# EAGLE schematic Aux Board V7.0 (EAGLE 9.6.2)

## Sheet 1 of 2
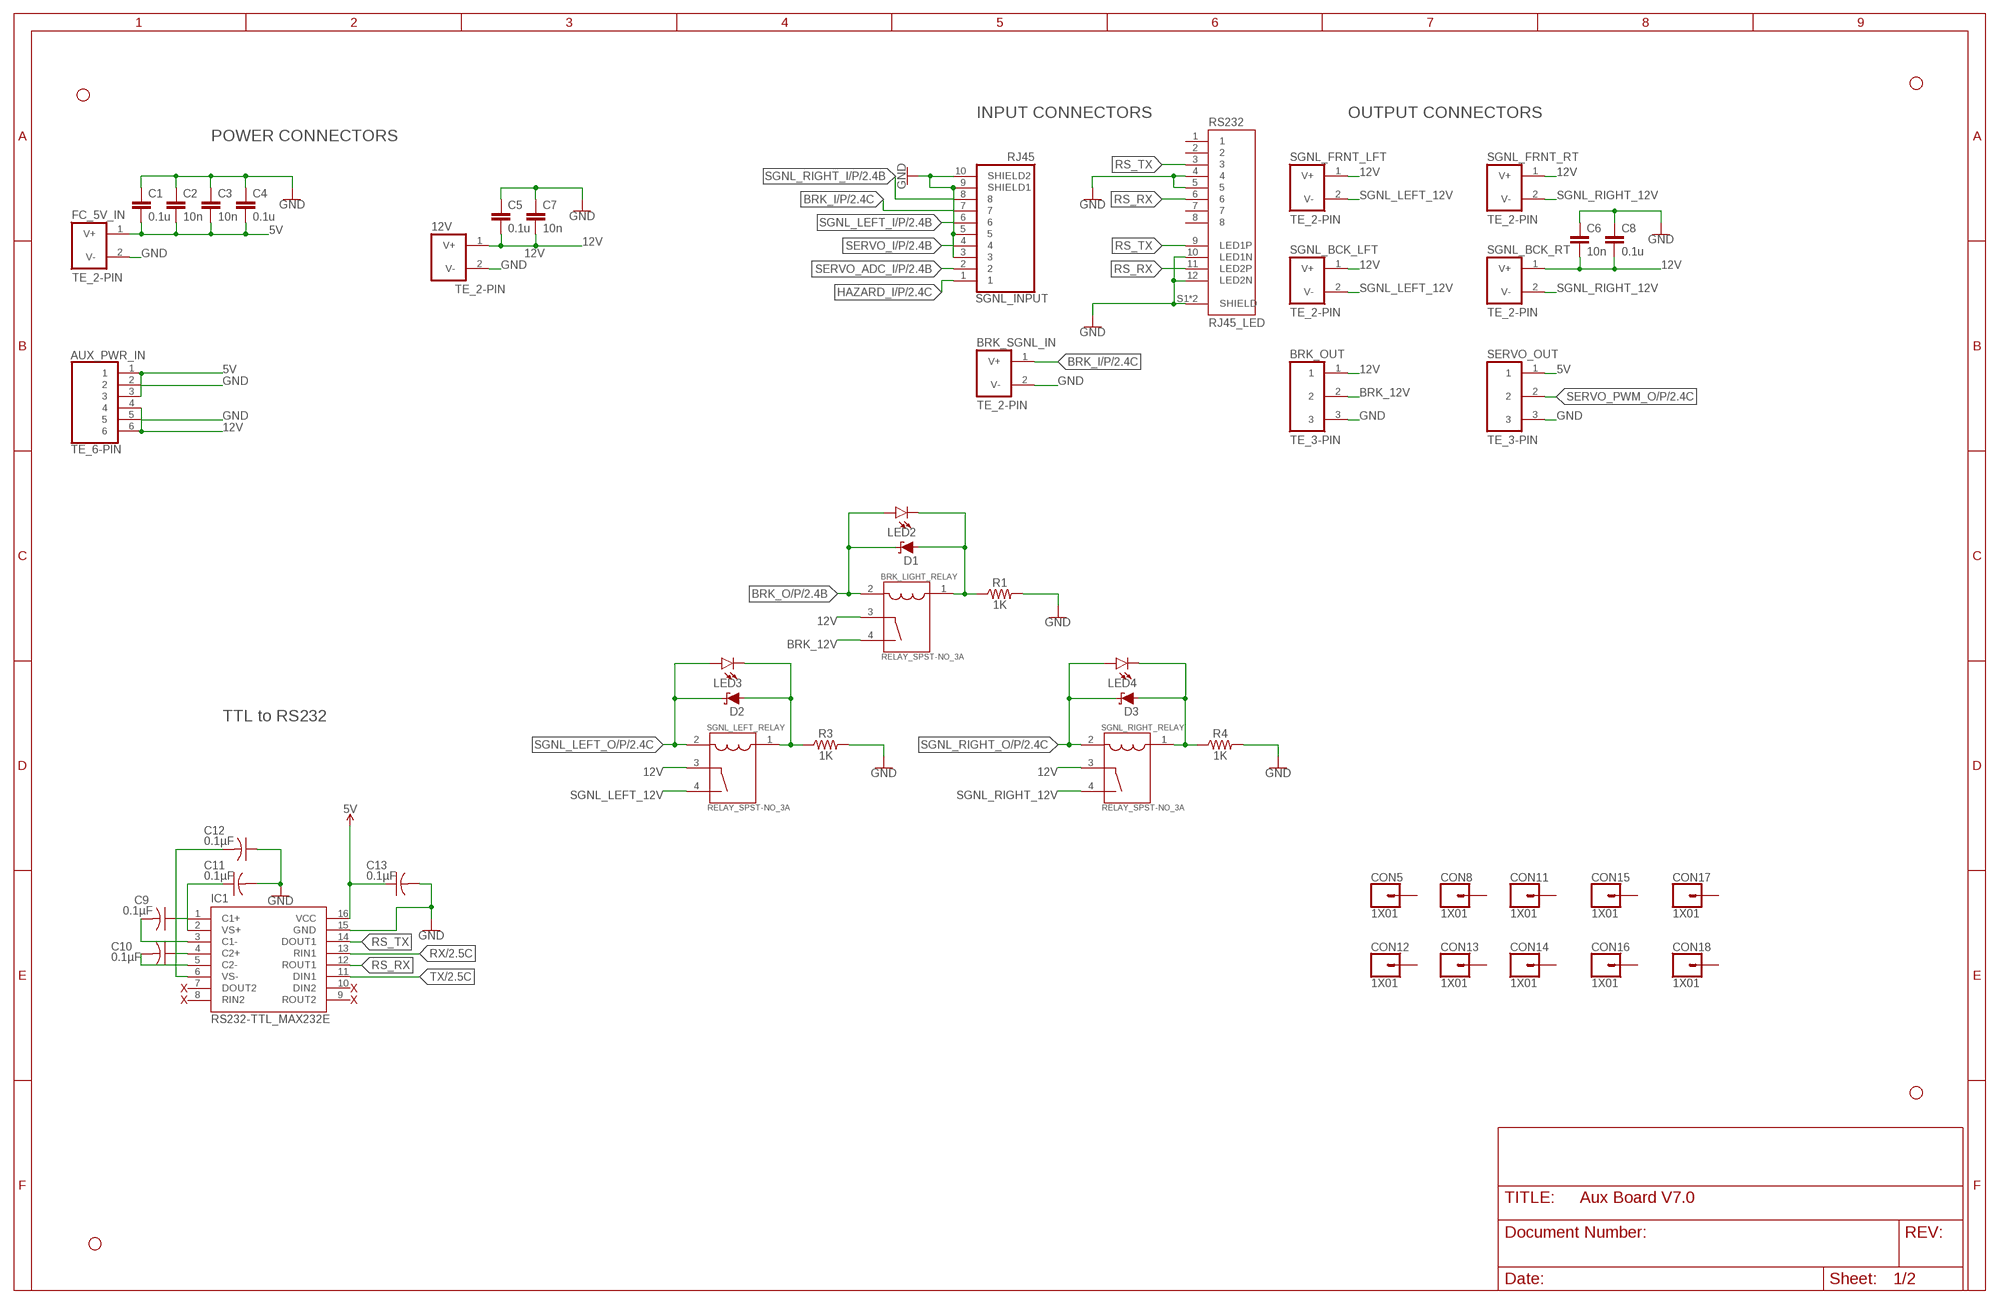
[diagram p0: schematic, sheet 1]

### Parts
12V  TE_2-PIN  [TE_2-PIN]
AUX_PWR_IN  TE_6-PIN  [TE_6-PIN]
BRK_LIGHT_RELAY  RELAY_SPST-NO_3A  [TE_1-1721081-2]
BRK_OUT  TE_3-PIN  [TE_3-PIN]
BRK_SGNL_IN  TE_2-PIN  [TE_2-PIN]
C1  0.1u  CAPACITOR_0805  [0805]
C2  10n  CAPACITOR_0805  [0805]
C3  10n  CAPACITOR_0805  [0805]
C4  0.1u  CAPACITOR_0805  [0805]
C5  0.1u  CAPACITOR_0805  [0805]
C6  10n  CAPACITOR_0805  [0805]
C7  10n  CAPACITOR_0805  [0805]
C8  0.1u  CAPACITOR_0805  [0805]
C9  0.1µF  C-USC0805  [C0805]
C10  0.1µF  C-USC0805  [C0805]
C11  0.1µF  C-USC0805  [C0805]
C12  0.1µF  C-USC0805  [C0805]
C13  0.1µF  C-USC0805  [C0805]
CON5  1X01  [1X01]
CON8  1X01  [1X01]
CON11  1X01  [1X01]
CON12  1X01  [1X01]
CON13  1X01  [1X01]
CON14  1X01  [1X01]
CON15  1X01  [1X01]
CON16  1X01  [1X01]
CON17  1X01  [1X01]
CON18  1X01  [1X01]
D1  DIODE_SCHOTTKY_DO-214AA  [DO214AA]
D2  DIODE_SCHOTTKY_DO-214AA  [DO214AA]
D3  DIODE_SCHOTTKY_DO-214AA  [DO214AA]
FC_5V_IN  TE_2-PIN  [TE_2-PIN]
H1  STAND-OFF  [STAND-OFF]
H2  STAND-OFF  [STAND-OFF]
H3  STAND-OFF  [STAND-OFF]
H4  STAND-OFF  [STAND-OFF]
IC1  RS232-TTL_MAX232E  [DIP16]
LED2  LED_0805  [0805_LED]
LED3  LED_0805  [0805_LED]
LED4  LED_0805  [0805_LED]
R1  1K  RESISTOR_0805  [0805]
R3  1K  RESISTOR_0805  [0805]
R4  1K  RESISTOR_0805  [0805]
RS232  RJ45_LED  [RJ45_LED]
SERVO_OUT  TE_3-PIN  [TE_3-PIN]
SGNL_BCK_LFT  TE_2-PIN  [TE_2-PIN]
SGNL_BCK_RT  TE_2-PIN  [TE_2-PIN]
SGNL_FRNT_LFT  TE_2-PIN  [TE_2-PIN]
SGNL_FRNT_RT  TE_2-PIN  [TE_2-PIN]
SGNL_INPUT  RJ45  [RJ45]
SGNL_LEFT_RELAY  RELAY_SPST-NO_3A  [TE_1-1721081-2]
SGNL_RIGHT_RELAY  RELAY_SPST-NO_3A  [TE_1-1721081-2]

### Nets
5V: AUX_PWR_IN.1 AUX_PWR_IN.3 C1.2 C2.2 C3.2 C4.2 C13.1 FC_5V_IN.1(V+) IC1.16(VCC) SERVO_OUT.1 ; also sheet 2
12V: 12V.1(V+) AUX_PWR_IN.4 AUX_PWR_IN.6 BRK_LIGHT_RELAY.3 BRK_OUT.1 C5.2 C6.2 C7.2 C8.2 SGNL_BCK_LFT.1(V+) SGNL_BCK_RT.1(V+) SGNL_FRNT_LFT.1(V+) SGNL_FRNT_RT.1(V+) SGNL_LEFT_RELAY.3 SGNL_RIGHT_RELAY.3
BRK_12V: BRK_LIGHT_RELAY.4 BRK_OUT.2
BRK_I/P: BRK_SGNL_IN.1(V+) SGNL_INPUT.7 ; also sheet 2
BRK_O/P: BRK_LIGHT_RELAY.2 D1.C LED2.1(A) ; also sheet 2
GND: 12V.2(V-) AUX_PWR_IN.2 AUX_PWR_IN.5 BRK_OUT.3 BRK_SGNL_IN.2(V-) C1.1 C2.1 C3.1 C4.1 C5.1 C6.1 C7.1 C8.1 C11.2 C12.1 C13.2 FC_5V_IN.2(V-) IC1.15(GND) R1.2 R3.2 R4.2 RS232.4 RS232.5 RS232.10(LED1N) RS232.12(LED2N) RS232.S1(SHIELD) RS232.S2(SHIELD) SERVO_OUT.3 SGNL_INPUT.3 SGNL_INPUT.5 SGNL_INPUT.9(SHIELD1) SGNL_INPUT.10(SHIELD2) ; also sheet 2
HAZARD_I/P: SGNL_INPUT.1 ; also sheet 2
N$1: BRK_LIGHT_RELAY.1 D1.A LED2.2(C) R1.1
N$6: C9.2 IC1.3(C1-)
N$7: C10.2 IC1.5(C2-)
N$9: C9.1 IC1.1(C1+)
N$10: C10.1 IC1.4(C2+)
N$11: C11.1 IC1.2(VS+)
N$12: C12.2 IC1.6(VS-)
N$13: D2.A LED3.2(C) R3.1 SGNL_LEFT_RELAY.1
N$14: D3.A LED4.2(C) R4.1 SGNL_RIGHT_RELAY.1
RS_RX: IC1.12(ROUT1) RS232.6 RS232.11(LED2P)
RS_TX: IC1.14(DOUT1) RS232.3 RS232.9(LED1P)
RX: IC1.13(RIN1) ; also sheet 2
SERVO_ADC_I/P: SGNL_INPUT.2 ; also sheet 2
SERVO_I/P: SGNL_INPUT.4 ; also sheet 2
SERVO_PWM_O/P: SERVO_OUT.2 ; also sheet 2
SGNL_LEFT_12V: SGNL_BCK_LFT.2(V-) SGNL_FRNT_LFT.2(V-) SGNL_LEFT_RELAY.4
SGNL_LEFT_I/P: SGNL_INPUT.6 ; also sheet 2
SGNL_LEFT_O/P: D2.C LED3.1(A) SGNL_LEFT_RELAY.2 ; also sheet 2
SGNL_RIGHT_12V: SGNL_BCK_RT.2(V-) SGNL_FRNT_RT.2(V-) SGNL_RIGHT_RELAY.4
SGNL_RIGHT_I/P: SGNL_INPUT.8 ; also sheet 2
SGNL_RIGHT_O/P: D3.C LED4.1(A) SGNL_RIGHT_RELAY.2 ; also sheet 2
TX: IC1.11(DIN1) ; also sheet 2
Unconnected: CON5.1 CON8.1 CON11.1 CON12.1 CON13.1 CON14.1 CON15.1 CON16.1 CON17.1 CON18.1 IC1.7(DOUT2) IC1.8(RIN2) IC1.9(ROUT2) IC1.10(DIN2) RS232.1 RS232.2 RS232.7 RS232.8

### Notes on the sheet
- INPUT CONNECTORS | OUTPUT CONNECTORS
- POWER CONNECTORS
- TTL to RS232
- X | X
- X | X

## Sheet 2 of 2
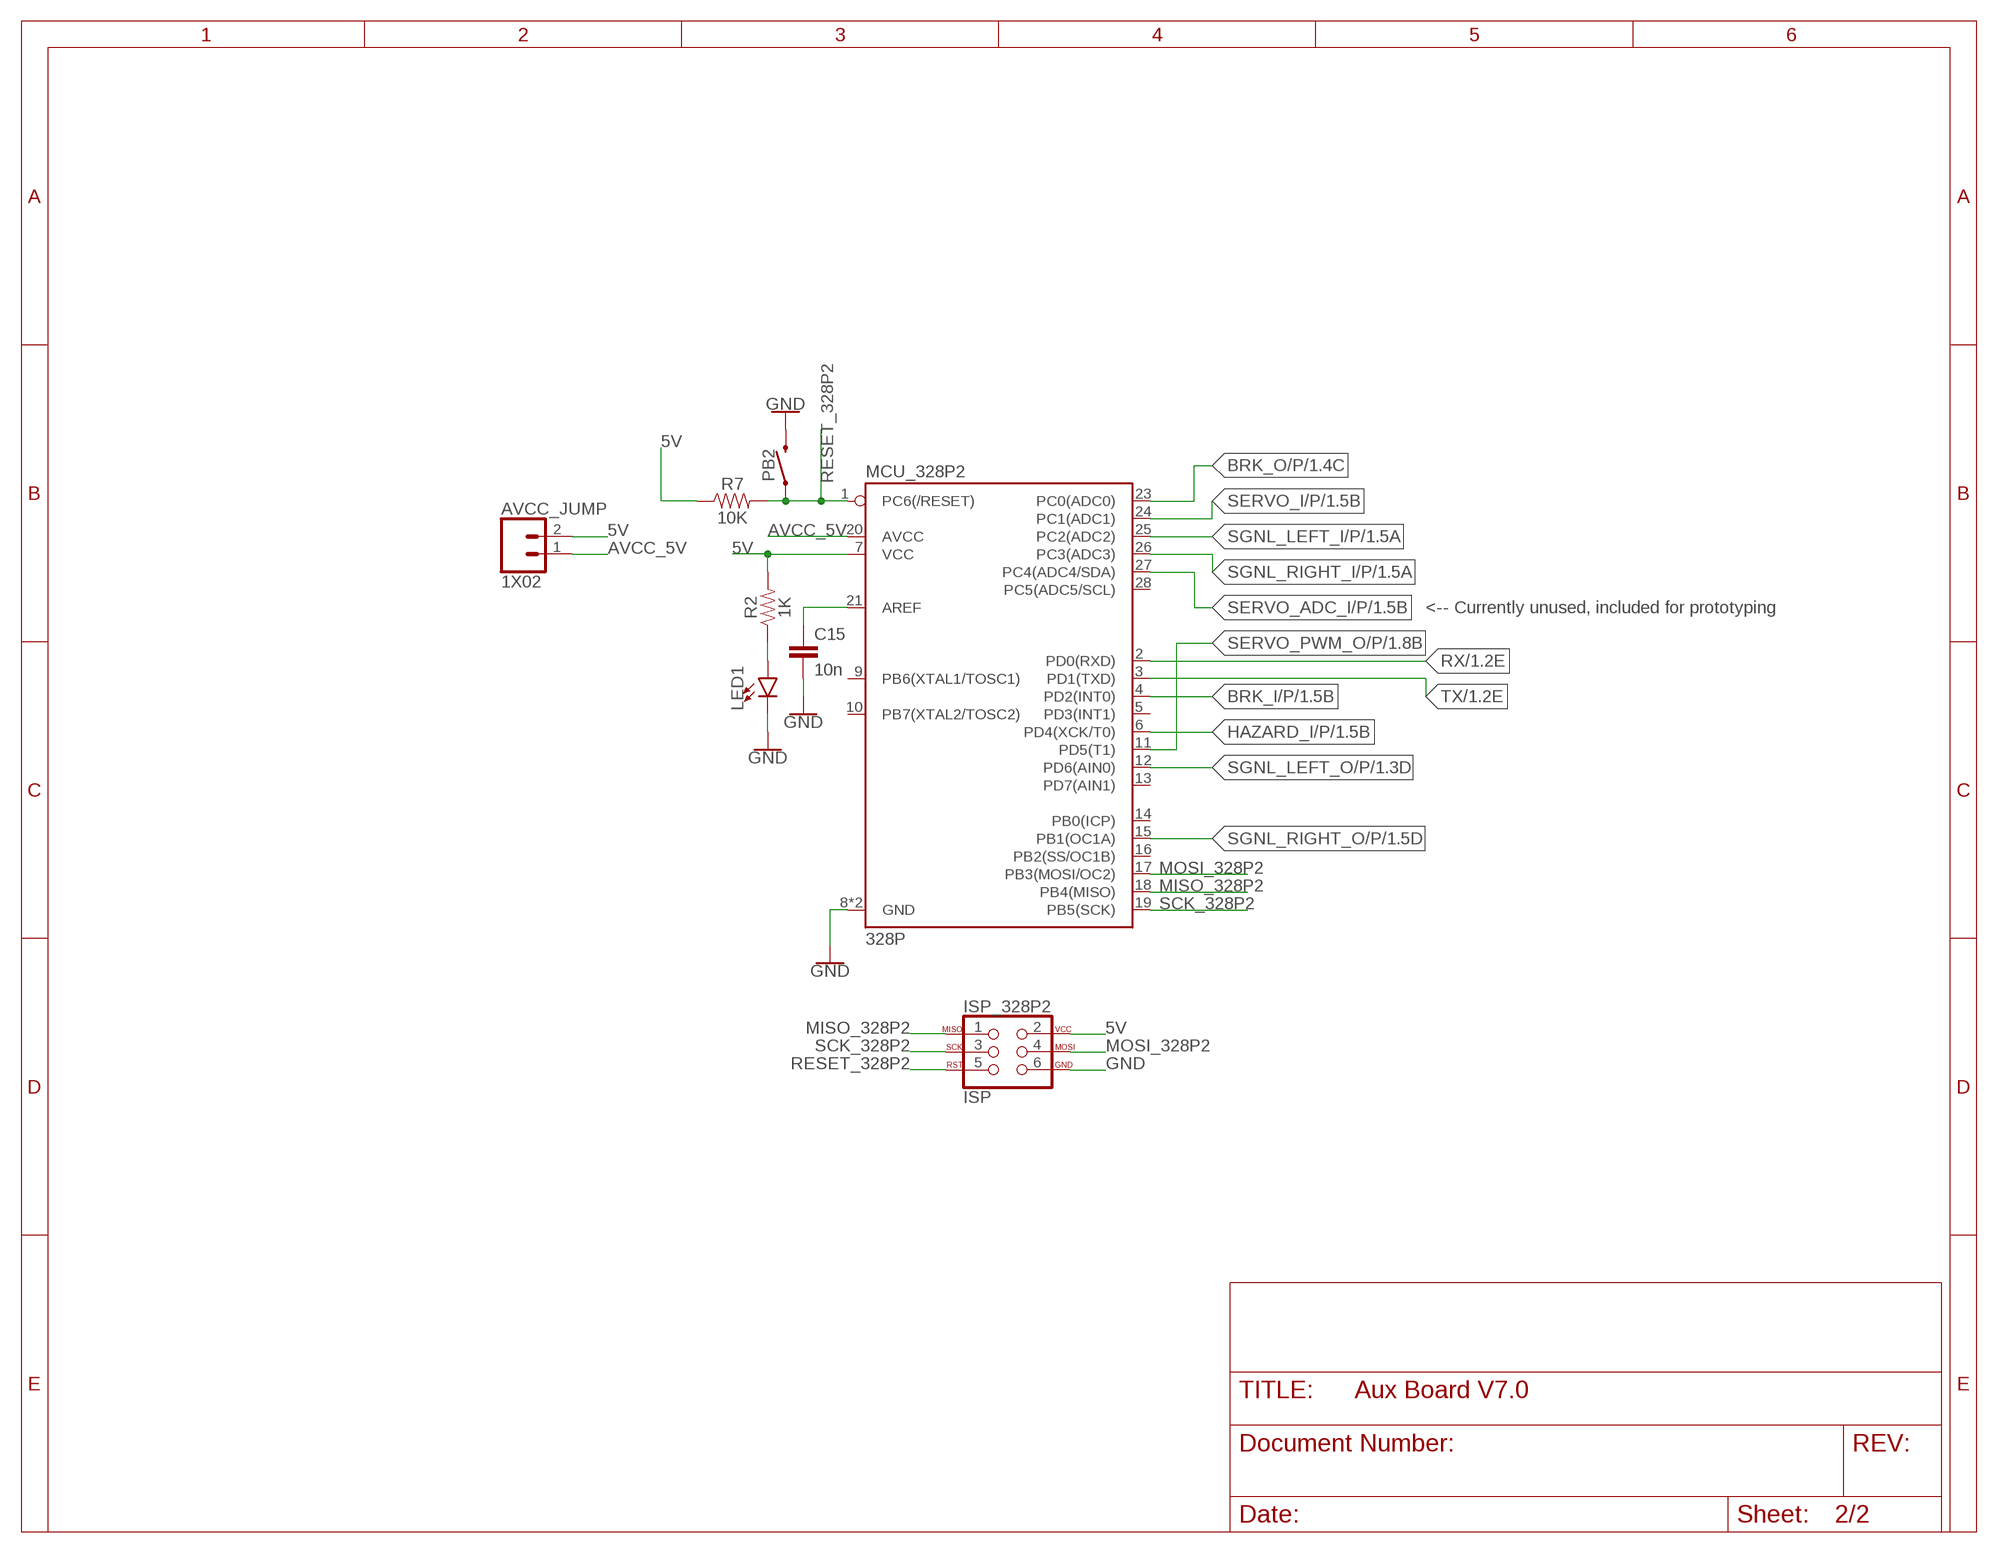
[diagram p1: schematic, sheet 2]

### Parts
AVCC_JUMP  1X02  [1X02]
C15  10n  CAPACITOR_0805  [0805]
ISP_328P2  ISP  [ISP_CONNECTOR]
LED1  LED_0805  [0805_LED]
MCU_328P2  328P  ATMEGA328P_DIP28  [DIP28]
PB2  PUSHBUTTON  [PUSHBUTTON]
R2  1K  RESISTOR_0805  [0805]
R7  10K  RESISTOR_0805  [0805]

### Nets
5V: AVCC_JUMP.2 ISP_328P2.2 MCU_328P2.7(VCC) R2.2 R7.1 ; also sheet 1
AREF: C15.1 MCU_328P2.21(AREF)
AVCC_5V: AVCC_JUMP.1 MCU_328P2.20(AVCC)
BRK_I/P: MCU_328P2.4(PD2(INT0)) ; also sheet 1
BRK_O/P: MCU_328P2.23(PC0(ADC0)) ; also sheet 1
GND: C15.2 ISP_328P2.6 LED1.2(C) MCU_328P2.8(GND) MCU_328P2.22(GND) PB2.3 PB2.4 ; also sheet 1
HAZARD_I/P: MCU_328P2.6(PD4(XCK/T0)) ; also sheet 1
MISO_328P2: ISP_328P2.1 MCU_328P2.18(PB4(MISO))
MOSI_328P2: ISP_328P2.4 MCU_328P2.17(PB3(MOSI/OC2))
N$8: LED1.1(A) R2.1
RESET_328P2: ISP_328P2.5 MCU_328P2.1(PC6(/RESET)) PB2.1 PB2.2 R7.2
RX: MCU_328P2.2(PD0(RXD)) ; also sheet 1
SCK_328P2: ISP_328P2.3 MCU_328P2.19(PB5(SCK))
SERVO_ADC_I/P: MCU_328P2.27(PC4(ADC4/SDA)) ; also sheet 1
SERVO_I/P: MCU_328P2.24(PC1(ADC1)) ; also sheet 1
SERVO_PWM_O/P: MCU_328P2.11(PD5(T1)) ; also sheet 1
SGNL_LEFT_I/P: MCU_328P2.25(PC2(ADC2)) ; also sheet 1
SGNL_LEFT_O/P: MCU_328P2.12(PD6(AIN0)) ; also sheet 1
SGNL_RIGHT_I/P: MCU_328P2.26(PC3(ADC3)) ; also sheet 1
SGNL_RIGHT_O/P: MCU_328P2.15(PB1(OC1A)) ; also sheet 1
TX: MCU_328P2.3(PD1(TXD)) ; also sheet 1
Unconnected: MCU_328P2.5(PD3(INT1)) MCU_328P2.9(PB6(XTAL1/TOSC1)) MCU_328P2.10(PB7(XTAL2/TOSC2)) MCU_328P2.13(PD7(AIN1)) MCU_328P2.14(PB0(ICP)) MCU_328P2.16(PB2(SS/OC1B)) MCU_328P2.28(PC5(ADC5/SCL))

### Notes on the sheet
- <-- Currently unused, included for prototyping

## Library data of the parts
12V BRK_SGNL_IN FC_5V_IN SGNL_BCK_LFT SGNL_BCK_RT SGNL_FRNT_LFT SGNL_FRNT_RT = EcoCar-Connectors:TE_2-PIN: 2 Pin TE Mini-Universal MATE-N-LOK - Use for signals and power connections Part Number: 1-770966-0 Digikey Part Number: A32471-ND Matching Plug: A25587-ND Matching Crimps: A100828CT-ND
AUX_PWR_IN = EcoCar-Connectors:TE_6-PIN: 6 Pin TE Mini-Universal MATE-N-LOK Part Number: 1-770969-0 Digikey Part Number: A32475-ND Matching Plug: A97674-ND Matching Crimps: A100828CT-ND
AVCC_JUMP = EcoCar-Connectors-2.54mm:1X02: 2.54mm (0.1") Header
BRK_LIGHT_RELAY SGNL_LEFT_RELAY SGNL_RIGHT_RELAY = EcoCar-Electromechanical:RELAY_SPST-NO_3A: 3A SPST-NO Relay Manufacturer: TE Connectivity Part Number: PCJ-105D3M,301 Digikey Part Number: PB2070-ND Ratings: 5VDC coil voltage 40mA coil current 30VDC/250VAC switching voltage 3A contact rating Electromechanical Relay 12VDC 720Ohm 3A SPST-NO (20.4x7x15)mm THT Power Relay Check availability <https://pricing.snapeda.com/parts/1-1721081-2/TE%20Connectivity/view-part?ref=eda>; AVAILABILITY: In Stock; COMMENT: 1-1721081-2; DESCRIPTION: General Purpose Relay SPST-NO (1 Form A) 12VDC Coil Through Hole; MF: TE Connectivity; MP: 1-1721081-2; PACKAGE: None; PRICE: None
BRK_OUT SERVO_OUT = EcoCar-Connectors:TE_3-PIN: 3 Pin TE Mini-Universal MATE-N-LOK Part Number: 1-770967-0 Digikey Part Number: A32473-ND Matching Plug: A25588-ND Matching Crimps: A100828CT-ND
C1-C8 C15 = EcoCar-Passives:CAPACITOR_0805
C9-C13 = rcl:C-US: CAPACITOR, American symbol; SPICEPREFIX: C
CON5 CON8 CON11-CON18 = EcoCar-Connectors-2.54mm:1X01: 2.54mm (0.1") Header
D1-D3 = EcoCar-Discrete-Semiconductors:DIODE_SCHOTTKY_DO-214AA
H1-H4 = EcoCar-Miscellaneous:STAND-OFF: Stand Off Drill holes for mechanically mounting via screws, standoffs, etc. Note: Use the keepout ring to avoid running the screw head into surrounding components. Variant Overviews STAND-OFF - Mechanical footprint for a #4 phillips button head screw. STAND-OFF-TIGHT - Mechanical footprint for a #4 phillips button head screw, Example SparkFun Products Screw - Phillips Head (1/4", 4-40, 10 pack) <https://www.sparkfun.com/products/10453> (PRT-10453) Screw - Phillips Head (1/2", 4-40, 10 pack) <https://www.sparkfun.com/products/10452> (PRT-10452) Screw - Phillips Head (3/4", 4-40, 10 pack) <https://www.sparkfun.com/products/10451> (PRT-10451) Screw - Phillips Head (1", 4-40, 10 pack) <https://www.sparkfun.com/products/10450> (PRT-10450)
IC1 = EcoCar-Integrated-Circuits:RS232-TTL_MAX232E: Dual 5V TTL to RS-232 Converter Manufacturer: Texas Instruments Part Number: MAX232EIN Digikey Part Number: 296-27963-5-ND
ISP_328P2 = EcoCar-Microcontrollers:ISP: ISP Header Use for programming microcontrollers such as the 328P
LED1-LED4 = EcoCar-Discrete-Semiconductors:LED_0805
MCU_328P2 = EcoCar-Microcontrollers:ATMEGA328P_DIP28: ATmega328P Manufacturer: Microchip Part Number: ATMEGA328P-PU Digikey Part Number: ATMEGA328P-PU-ND; PROD_ID: IC-09136
PB2 = EcoCar-Electromechanical:PUSHBUTTON: Pushbutton Manufacturer: TE Connectivity ALCOSWITCH Switches Part Number: 1825910-6 Digikey Part Number: 450-1650-ND
R1-R4 R7 = EcoCar-Passives:RESISTOR_0805
RS232 = EcoCar-Connectors:RJ45_LED: RJ45 Connector - Use for signals and low power connections Shielded with LEDs Part Number: 6116173-1 Shielded with LEDs Digikey Part Number: A122645-ND Check availability <https://pricing.snapeda.com/parts/6116173-4/TE%20Connectivity/view-part?ref=eda>; AVAILABILITY: In Stock; COMMENT: 6116173-4; DESCRIPTION: Conn Telephone/Telecom F 8 POS 2.54mm Solder RA Thru-Hole 12 Terminal 1 Port Tray Cat 5; EU_ROHS_COMPLIANCE: Compliant; MF: TE Connectivity; MP: 6116173-4; PACKAGE: None; PRICE: None; PURCHASE-URL: https://pricing.snapeda.com/search/part/6116173-4/?ref=eda
SGNL_INPUT = EcoCar-Connectors:RJ45: RJ45 Connector - Use for signals and low power connections Unshielded Part Number: RJHSE-5080 Unshielded Digikey Part Number: RJHSE-5080-ND Shielded Part Number: RJHSE5E80 Shielded Digikey Part Number: RJHSE5E80-ND